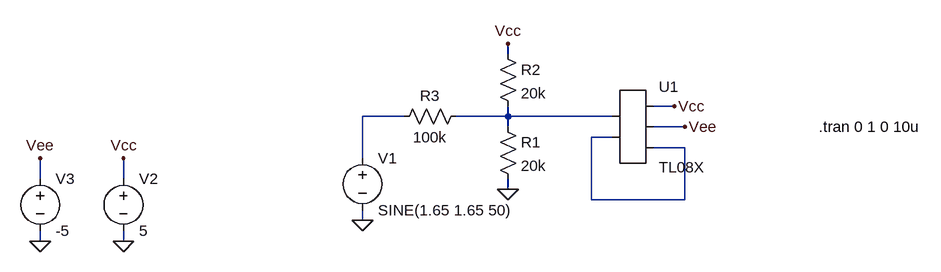
[diagram p0: schematic signal_conditioning.asc]
signal_conditioning.asc, the LTspice schematic file:
Version 4
SHEET 1 880 680
WIRE -80 64 -80 48
WIRE 176 144 144 144
WIRE -240 160 -304 160
WIRE -80 160 -80 144
WIRE -80 160 -160 160
WIRE 80 160 -80 160
WIRE -80 176 -80 160
WIRE 192 176 144 176
WIRE 80 192 48 192
WIRE 192 208 144 208
WIRE -304 224 -304 160
WIRE -800 256 -800 224
WIRE -672 256 -672 224
WIRE -80 272 -80 256
WIRE 48 288 48 192
WIRE 192 288 192 208
WIRE 192 288 48 288
WIRE -304 320 -304 304
WIRE -800 352 -800 336
WIRE -672 352 -672 336
FLAG 176 144 Vcc
FLAG -304 320 0
FLAG -672 352 0
FLAG -672 224 Vcc
FLAG -800 352 0
FLAG -800 224 Vee
FLAG 192 176 Vee
FLAG -80 48 Vcc
FLAG -80 272 0
SYMBOL AutoGenerated\\TL08X 112 176 R0
SYMATTR InstName U1
SYMBOL voltage -304 208 R0
WINDOW 123 0 0 Left 0
WINDOW 39 0 0 Left 0
SYMATTR InstName V1
SYMATTR Value SINE(1.65 1.65 50)
SYMBOL voltage -672 240 R0
WINDOW 123 0 0 Left 0
WINDOW 39 0 0 Left 0
SYMATTR InstName V2
SYMATTR Value 5
SYMBOL voltage -800 240 R0
WINDOW 123 0 0 Left 0
WINDOW 39 0 0 Left 0
SYMATTR InstName V3
SYMATTR Value -5
SYMBOL res -96 160 R0
SYMATTR InstName R1
SYMATTR Value 20k
SYMBOL res -96 48 R0
SYMATTR InstName R2
SYMATTR Value 20k
SYMBOL res -144 144 R90
WINDOW 0 0 56 VBottom 2
WINDOW 3 32 56 VTop 2
SYMATTR InstName R3
SYMATTR Value 100k
TEXT 398 176 Left 2 !.tran 0 1 0 10u

The netlist it stands for:
* signal_conditioning.asc
* U1: TL08X (symbol AutoGenerated\TL08X not available, pins judged from their places): pin1=N002 pin2=N003 pin3=Vcc pin4=Vee pin5=N003
V1 N001 0 SINE(1.65 1.65 50)
V2 Vcc 0 5
V3 Vee 0 -5
R1 N002 0 20k
R2 Vcc N002 20k
R3 N002 N001 100k
.tran 0 1 0 10u
.backanno
.end